# Altium schematic sheet Sheet6.SchDoc
size A3
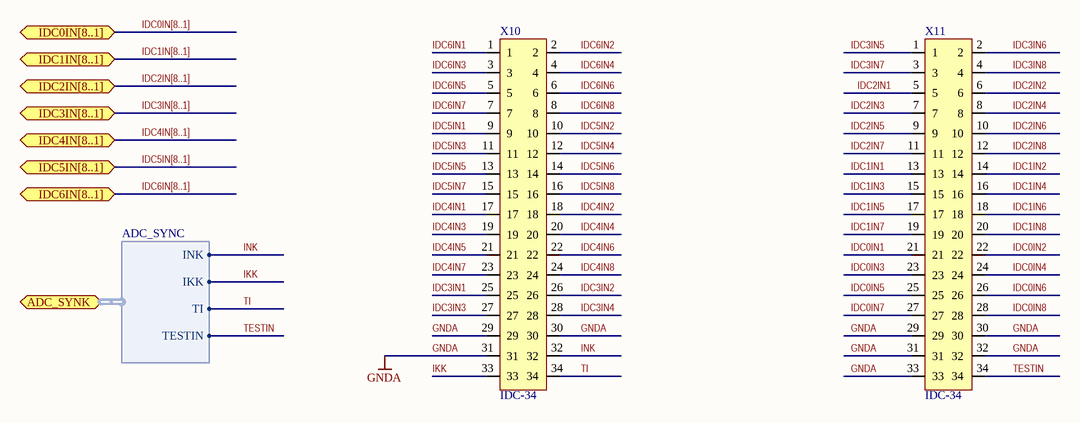
[diagram p0: Sheet6.SchDoc]

## Parts
X10  IDC-34  [PLD-34]
X11  IDC-34  [PLD-34]

## Ports
ADC_SYNK (harness ADC_SYNC), IDC0IN[8..1], IDC1IN[8..1], IDC2IN[8..1], IDC3IN[8..1], IDC4IN[8..1], IDC5IN[8..1], IDC6IN[8..1]

## Harnesses
ADC_SYNC: INK, IKK, TI, TESTIN

## Nets
GNDA: X10.29 X10.30 X10.31 X11.29 X11.30 X11.31 X11.32 X11.33
IDC0IN1: X11.21
IDC0IN2: X11.22
IDC0IN3: X11.23
IDC0IN4: X11.24
IDC0IN5: X11.25
IDC0IN6: X11.26
IDC0IN7: X11.27
IDC0IN8: X11.28
IDC1IN1: X11.13
IDC1IN2: X11.14
IDC1IN3: X11.15
IDC1IN4: X11.16
IDC1IN5: X11.17
IDC1IN6: X11.18
IDC1IN7: X11.19
IDC1IN8: X11.20
IDC2IN1: X11.5
IDC2IN2: X11.6
IDC2IN3: X11.7
IDC2IN4: X11.8
IDC2IN5: X11.9
IDC2IN6: X11.10
IDC2IN7: X11.11
IDC2IN8: X11.12
IDC3IN1: X10.25
IDC3IN2: X10.26
IDC3IN3: X10.27
IDC3IN4: X10.28
IDC3IN5: X11.1
IDC3IN6: X11.2
IDC3IN7: X11.3
IDC3IN8: X11.4
IDC4IN1: X10.17
IDC4IN2: X10.18
IDC4IN3: X10.19
IDC4IN4: X10.20
IDC4IN5: X10.21
IDC4IN6: X10.22
IDC4IN7: X10.23
IDC4IN8: X10.24
IDC5IN1: X10.9
IDC5IN2: X10.10
IDC5IN3: X10.11
IDC5IN4: X10.12
IDC5IN5: X10.13
IDC5IN6: X10.14
IDC5IN7: X10.15
IDC5IN8: X10.16
IDC6IN1: X10.1
IDC6IN2: X10.2
IDC6IN3: X10.3
IDC6IN4: X10.4
IDC6IN5: X10.5
IDC6IN6: X10.6
IDC6IN7: X10.7
IDC6IN8: X10.8
IKK: X10.33 ; port ADC_SYNK.IKK
INK: X10.32 ; port ADC_SYNK.INK
TESTIN: X11.34 ; port ADC_SYNK.TESTIN
TI: X10.34 ; port ADC_SYNK.TI

## Buses and harness runs
bus IDC0IN[8..1] = port IDC0IN[8..1]
bus IDC1IN[8..1] = port IDC1IN[8..1]
bus IDC2IN[8..1] = port IDC2IN[8..1]
bus IDC3IN[8..1] = port IDC3IN[8..1]
bus IDC4IN[8..1] = port IDC4IN[8..1]
bus IDC5IN[8..1] = port IDC5IN[8..1]
bus IDC6IN[8..1] = port IDC6IN[8..1]

## Library data of the parts
X10 X11 = IDC34: PLD-34 or IDC 34